# EAGLE design pc_tinyecg_max30001 (EAGLE 9.6.2)
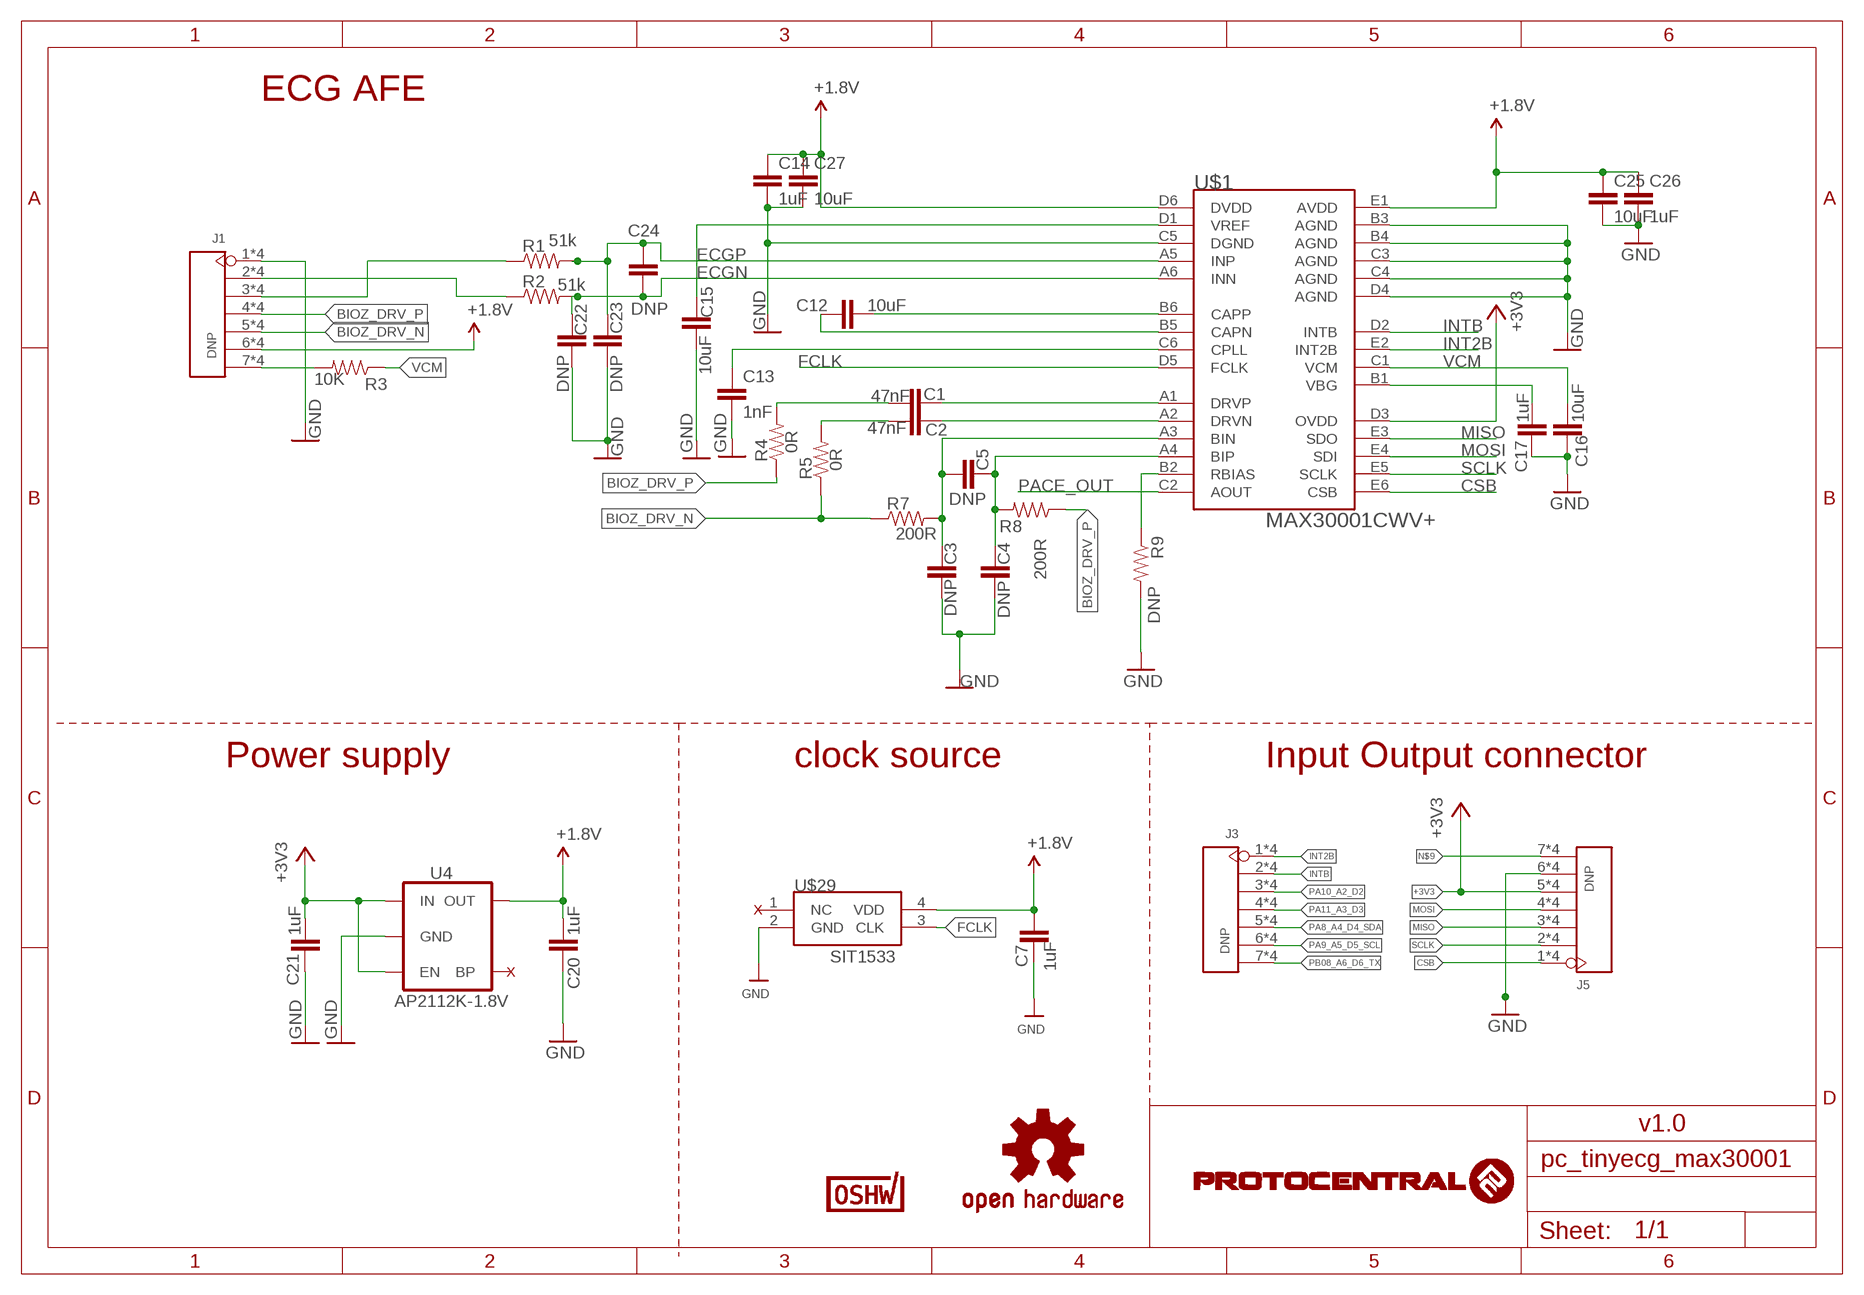
[diagram p0: schematic, sheet 1]

## Parts
C1  47nF  C-EUC0402  [C0402]
C2  47nF  C-EUC0402  [C0402]
C3  DNP  C-EUC0402  [C0402]
C4  DNP  C-EUC0402  [C0402]
C5  DNP  C-EUC0402  [C0402]
C7  1uF  C-EUC0402  [C0402]
C12  10uF  C-EUC0402  [C0402]
C13  1nF  C-EUC0402  [C0402]
C14  1uF  C-EUC0402  [C0402]
C15  10uF  C-EUC0402  [C0402]
C16  10uF  C-EUC0402  [C0402]
C17  1uF  C-EUC0402  [C0402]
C20  1uF  C-EUC0402  [C0402]
C21  1uF  C-EUC0402  [C0402]
C22  DNP  C-EUC0402  [C0402]
C23  DNP  C-EUC0402  [C0402]
C24  DNP  C-EUC0402  [C0402]
C25  10uF  C-EUC0402  [C0402]
C26  1uF  C-EUC0402  [C0402]
C27  10uF  C-EUC0402  [C0402]
J1  DNP  HEADER-7P-HALF-HOLE-2.54  [H7-HALF-HOLE-2.54]
J3  DNP  HEADER-7P-HALF-HOLE-2.54  [H7-HALF-HOLE-2.54]
J5  DNP  HEADER-7P-HALF-HOLE-2.54  [H7-HALF-HOLE-2.54]
R1  51k  RESISTOR0402-RES  [0402-RES]
R2  51k  RESISTOR0402-RES  [0402-RES]
R3  10K  RESISTOR0402-RES  [0402-RES]
R4  0R  RESISTOR0402-RES  [0402-RES]
R5  0R  RESISTOR0402-RES  [0402-RES]
R7  200R  RESISTOR0402-RES  [0402-RES]
R8  200R  RESISTOR0402-RES  [0402-RES]
R9  DNP  RESISTOR0402-RES  [0402-RES]
U4  AP2112K-1.8V  V_REG_LDOSMD  [SOT23-5]
U$1  MAX30001CWV+  [30WLP]
U$14  OSHW-LOGOM  [OSHW-LOGO-M]
U$29  SIT1533  [SIT1533]
U$35  CERT-SMALL  [CERT-SMALL-SILK]

## Nets
+1.8V: C7.2 C14.1 C20.2 C25.1 C26.1 C27.1 J1.6 J1.18 J1.P$6 J1.P$9 U4.5(OUT) U$1.D6(DVDD) U$1.E1(AVDD) U$29.4(VDD)
+3V3: C21.2 J5.5 J5.17 J5.P$5 J5.P$10 U4.1(IN) U4.3(EN) U$1.D3(OVDD)
BIOZ_DRV_N: J1.5 J1.17 J1.P$5 J1.P$10 R5.1 R7.1
BIOZ_DRV_P: J1.4 J1.16 J1.P$4 J1.P$11 R4.1 R8.1
CSB: J5.1 J5.13 J5.P$1 J5.P$14 U$1.E6(CSB)
ECGN: C22.1 C24.2 R2.2 U$1.A6(INN)
ECGN1: J1.2 J1.14 J1.P$2 J1.P$13 R2.1
ECGP: C23.1 C24.1 R1.2 U$1.A5(INP)
ECGP1: J1.3 J1.15 J1.P$3 J1.P$12 R1.1
FCLK: U$1.D5(FCLK) U$29.3(CLK)
GND: C3.2 C4.2 C7.1 C13.2 C14.2 C15.2 C16.2 C17.2 C20.1 C21.1 C22.2 C23.2 C25.2 C26.2 C27.2 J1.1 J1.13 J1.P$1 J1.P$14 J5.6 J5.18 J5.P$6 J5.P$9 R9.2 U4.2(GND) U$1.B3(AGND) U$1.B4(AGND) U$1.C3(AGND) U$1.C4(AGND) U$1.C5(DGND) U$1.D4(AGND) U$29.2(GND)
INT2B: J3.1 J3.13 J3.P$1 J3.P$14 U$1.E2(INT2B)
INTB: J3.2 J3.14 J3.P$2 J3.P$13 U$1.D2(INTB)
MISO: J5.3 J5.15 J5.P$3 J5.P$12 U$1.E3(SDO)
MOSI: J5.4 J5.16 J5.P$4 J5.P$11 U$1.E4(SDI)
N$1: C12.1 U$1.B6(CAPP)
N$2: C1.2 U$1.A1(DRVP)
N$3: C2.1 R5.2
N$4: C2.2 U$1.A2(DRVN)
N$5: C3.1 C5.1 R7.2 U$1.A3(BIN)
N$6: C4.1 C5.2 R8.2 U$1.A4(BIP)
N$7: R9.1 U$1.B2(RBIAS)
N$8: J1.7 J1.19 J1.P$7 J1.P$8 R3.2
N$9: J5.7 J5.19 J5.P$7 J5.P$8
N$10: C13.1 U$1.C6(CPLL)
N$11: C1.1 R4.2
N$12: C12.2 U$1.B5(CAPN)
N$13: C15.1 U$1.D1(VREF)
N$15: C17.1 U$1.B1(VBG)
PA8_A4_D4_SDA: J3.5 J3.17 J3.P$5 J3.P$10
PA9_A5_D5_SCL: J3.6 J3.18 J3.P$6 J3.P$9
PA10_A2_D2: J3.3 J3.15 J3.P$3 J3.P$12
PA11_A3_D3: J3.4 J3.16 J3.P$4 J3.P$11
PACE_OUT: U$1.C2(AOUT)
PB08_A6_D6_TX: J3.7 J3.19 J3.P$7 J3.P$8
SCLK: J5.2 J5.14 J5.P$2 J5.P$13 U$1.E5(SCLK)
VCM: C16.1 R3.1 U$1.C1(VCM)
Unconnected: U4.4(BP) U$29.1(NC)

## Notes on the sheet
- ECG AFE
- Power supply | clock source | Input Output connector
- X
- X
- v1.0

## Library data of the parts
C1-C5 C7 C12-C17 C20-C27 = rcl:C-EU: CAPACITOR, European symbol; SPICEPREFIX: C
J1 J3 J5 = circuitects:HEADER-7P-HALF-HOLE
R1-R5 R7-R9 = SparkFun:RESISTOR: Resistor Basic schematic elements and footprints for 0603, 1206, and PTH resistors.
U4 = SparkFun-PowerIC:V_REG_LDO: Voltage Regulator LDO Standard 150mA LDO voltage regulator in SOT-23 layout. Micrel part MIC5205. BP (by-pass) pin is used to lower output noise with 470pF cap.; PROD_ID: VREG-12457
U$1 = circuitects:MAX30001CWV+
U$14 = SparkFun:OSHW-LOGO: Open Source Hardware Logo This logo indicates the piece of hardware it is found on incorporates a OSHW license and/or adheres to the definition of open source hardware found here: http://freedomdefined.org/OSHW
U$29 = circuitects:SIT1533
U$35 = OSHWA:CERT

## Board
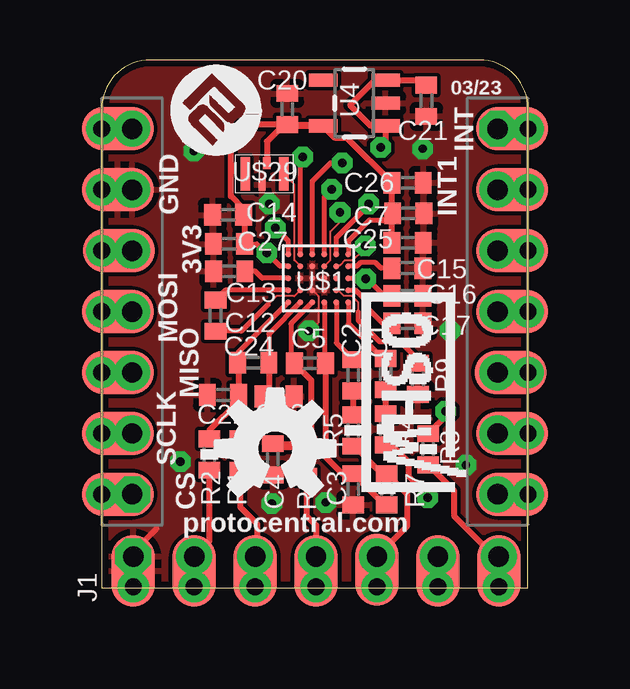
[diagram p1: board, top side]
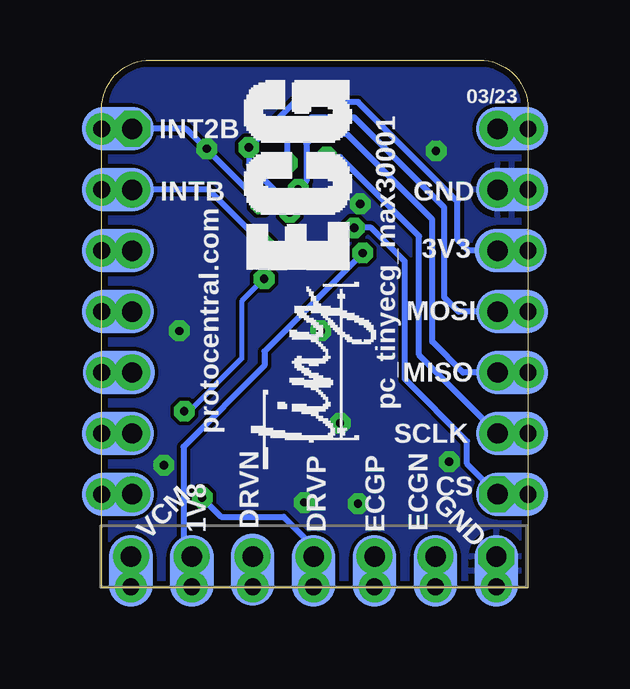
[diagram p2: board, bottom side, seen from below]

Size 17.78 x 22 mm. Coordinates in mm from the lower left corner, seen from the top.
Outline: 17.78,0 17.78,19.97 arc90 15.75,22 2.03,22 arc90 0,19.97 0,0 17.78,0
Copper layers (1*16): Top 0.035mm / dielectric 1.5mm / Bottom 0.035mm
Design rules "Circuitects-Rules *": minimum track width 2mil, minimum drill 0.05mm, track to track 0.06858125mm, track to pad 0.06858125mm, pad to pad 0.06858125mm, via to via 4mil, smd to smd 4mil, copper to edge 10mil, drill to drill 8mil, minimum pad ring 12mil, minimum via ring 10mil, stop-mask expansion 4mil, vias tented up to drill 25mil, thermal gap 10mil

### Footprints (pad centres in the part's own frame; a part is rotated, then mirrored left to right if it is on the bottom)
C0402 = smd 0.7 x 0.9: 1 -0.65,0; 2 0.65,0
H7-HALF-HOLE-2.54 = drill 0.85 pad 1.5 octagon: 1 0,7.62 | drill 0.85 pad 1.5: 2 0,5.08; 3 0,2.54; 4 0,0; 5 0,-2.54; 6 0,-5.08; 7 0,-7.62 | drill 0.7 pad 1.27: 13 -1.27,7.62; 14 -1.27,5.08; 15 -1.27,2.54; 16 -1.27,0; 17 -1.27,-2.54; 18 -1.27,-5.08; 19 -1.27,-7.62 | smd 3 x 1.82: P$1 -0.6,7.62; P$2 -0.6,5.08; P$3 -0.6,2.54; P$4 -0.6,0; P$5 -0.55,-2.54; P$6 -0.6,-5.08; P$7 -0.6,-7.62 | smd 3 x 1.82 bottom: P$8 -0.6,-7.62; P$9 -0.6,-5.08; P$10 -0.55,-2.54; P$11 -0.6,0; P$12 -0.6,2.54; P$13 -0.6,5.08; P$14 -0.6,7.62
0402-RES = smd 0.7 x 0.9: 1 -0.65,0; 2 0.65,0
SOT23-5 = smd 0.55 x 1.2: 1 -0.95,-1.3; 2 0,-1.3; 3 0.95,-1.3; 4 0.95,1.3; 5 -0.95,1.3
30WLP = smd 0.25 x 0.25: A1 -1.25,1; A2 -0.75,1; A3 -0.25,1; A4 0.25,1; A5 0.75,1; A6 1.25,1; B1 -1.25,0.5; B2 -0.75,0.5; B3 -0.25,0.5; B4 0.25,0.5; B5 0.75,0.5; B6 1.25,0.5; C1 -1.25,0; C2 -0.75,0; C3 -0.25,0; C4 0.25,0; C5 0.75,0; C6 1.25,0; D1 -1.25,-0.5; D2 -0.75,-0.5; D3 -0.25,-0.5; D4 0.25,-0.5; D5 0.75,-0.5; D6 1.25,-0.5; E1 -1.25,-1; E2 -0.75,-1; E3 -0.25,-1; E4 0.25,-1; E5 0.75,-1; E6 1.25,-1
SIT1533 = smd 0.4 x 1.4: 1 -0.8,0; 3 0.8,0 | smd 0.3 x 0.5: 2 -0.1,-0.45; 4 0.1,0.45

### Placement (x,y rotation side)
C1  11.84,8.9 90 top
C2  10.49,8.85 90 top
C3  10.49,4.1 270 top
C4  7.14,5.35 270 top
C5  8.69,9.35 180 top
C7  12.79,15.6 180 top
C12  4.75,11.34 270 top
C13  5.32,13.19 180 top
C14  5.27,15.54 180 top
C15  12.75,13.32 0 top
C16  12.75,12.17 0 top
C17  12.75,11.02 0 top
C20  7.74,19.95 270 top
C21  13.54,20.3 90 top
C22  5.06,8.03 180 top
C23  7.37,7.97 0 top
C24  6.32,9.37 180 top
C25  12.76,14.38 0 top
C26  12.76,16.88 0 top
C27  5.31,14.33 180 top
J1  8.94,1.3 90 top
J3  16.51,11.51 0 bottom
J5  1.27,11.51 180 bottom
R1  5.79,5.55 90 top
R2  4.49,5.55 90 top
R3  13.62,5.77 270 top
R4  11.84,6.6 90 top
R5  10.49,6.55 90 top
R7  11.89,4.1 270 top
R8  8.54,5.3 90 top
R9  13.19,8.7 270 top
U4  10.54,20.2 90 top
U$1  9.04,12.9 180 top
U$4  [TNYECG_LOGO]  5.99,3.9 90 bottom
U$5  [PCROUNDLOGO]  -0.76,15.85 0 top
U$14  7.24,5.8 0 top
U$29  6.79,17.25 0 top
U$35  10.84,8.15 270 top

### Tracks (layer width: path | path; a pad name or v marks a point on that pad's centre or on a via)
+1.8V  (via drill 0.35)
  Top 0.2: 11.71,15.33 11.17,15.33 10.29,14.45 U$1.E1 | C27.1 6.46,14.33 6.84,13.95 v6.89,13.95 7.44,13.4 U$1.D6
  Top 0.254: C26.1 12.14,16.85 | C27.1 5.96,15.5 C14.1 5.92,15.79 5.39,16.32 5.39,18.9 5.79,19.3 C20.2 9.19,19.3 U4.5 | U4.5 7.54,19.25 6.89,18.6 U$29.4 | U4.5 9.74,18.75 10.24,18.75 C26.1 | J1.18 J1.6 J1.P$9 | C26.1 12.11,15.63 C7.2 | C25.1 12.11,15.57 C7.2 | 11.71,15.33 11.87,15.33 C7.2
  Bottom 0.254: v6.89,13.95 10.99,9.85 10.99,9.25 14.37,5.87 14.37,1.65 J1.6 J1.P$9
+3V3  (via drill 0.35)
  Top 0.076: U$1.D3 9.54,13.65 9.54,14.85 9.89,15.2 9.89,15.59 v9.94,15.64
  Top 0.254: C21.2 13.34,21.15 U4.3 11.79,21.2 11.44,21.2 10.37,20.12 11.24,19.25 U4.1 11.84,18.55 v11.64,18.35 | J5.P$10 J5.5
  Bottom 0.254: J5.17 J5.5 | J5.5 2.49,14.05 2.94,14.5 2.94,16.1 7.09,20.25 9.74,20.25 v11.64,18.35 11.64,17.65 10.4,16.41 10.4,16.11 v9.94,15.65 v9.94,15.64 | J5.P$10 J5.5
BIOZ_DRV_N
  Top 0.254: R5.1 10.54,5.9 11.69,4.75 R7.1 12.74,3.9 12.74,2.56 J1.5 J1.P$10 J1.17
  Bottom 0.254: J1.P$10 J1.17
BIOZ_DRV_P  (via drill 0.35)
  Top 0.254: J1.16 J1.4 | R4.1 12.09,5.95 12.79,5.25 12.79,4.65 13.59,3.85 v13.59,3.75 | R8.1 8.54,3 8.94,2.6 J1.4 | J1.P$11 J1.4
  Bottom 0.254: v13.59,3.75 12.79,2.95 10.19,2.95 8.94,1.7 J1.4 J1.P$11
CSB  (via drill 0.35)
  Top 0.2: U$1.E6 7.79,14.45 v7.24,15
  Top 0.254: J5.P$14 J5.1
  Bottom 0.254: J5.13 J5.P$14 J5.1 2.54,5.16 2.54,6.1 5.14,8.7 5.14,13.6 6.54,15 v7.24,15
ECGN
  Top 0.2: U$1.A6 5.67,9.78 C24.2
  Top 0.254: C24.2 5.71,9.33 C22.1 5.71,7.77 4.49,6.55 R2.2
ECGN1
  Top 0.254: R2.1 4.49,1.93 J1.2 | J1.14 J1.2 | J1.P$13 J1.2
  Bottom 0.254: J1.P$13 J1.2
ECGP
  Top 0.2: U$1.A5 6.97,10.58 C24.1
  Top 0.254: C24.1 6.97,8.22 C23.1 6.72,7.13 R1.2
ECGP1
  Top 0.254: R1.1 5.79,3.35 6.49,2.65 6.49,1.39 J1.3 | J1.15 J1.3 | J1.P$12 J1.3
  Bottom 0.254: J1.P$12 J1.3
FCLK
  Top 0.076: U$1.D5 8.04,13.65 8.04,16.8 U$29.3
GND  (via drill 0.35)
  Top 0.076: U$1.B4 9.04,12.15 9.04,11.05 8.69,10.7
  Top 0.254: J1.13 J1.P$14 J1.1 1.32,1.48 2.29,2.45 | J5.P$9 J5.6
  Bottom 0.254: J1.P$14 J1.1 | J5.6 J5.P$9 J5.18
  other vias: 13.39,18.3 14.54,10.7 8.64,10.7 6.99,16 7.09,3.5 15.19,5.1 3.29,5.25 3.84,18.2 7.84,6.85 9.34,3.55
  pour Bottom (isolate 0.152): 0,0 17.78,0 17.78,22.43 0,22.43
  pour Top (isolate 0.152): 0,0 0,22.43 17.78,22.43 17.78,0
INT2B  (via drill 0.35)
  Top 0.2: U$1.E2 9.79,14.6 11.14,15.95 v11.14,16
  Top 0.254: J3.P$14 J3.1
  Bottom 0.254: v11.14,16 14.27,19.13 J3.1 J3.13 J3.P$14
INTB  (via drill 0.35)
  Top 0.076: U$1.D2 9.85,13.46 9.95,13.46 10.14,13.65 10.49,13.65 10.89,14.05
  Top 0.2: v10.99,14.25 10.89,14.25 10.89,14.05
  Top 0.254: J3.P$13 J3.2
  Bottom 0.254: v10.99,14.25 13.33,16.59 J3.2 J3.14 J3.P$13
MISO  (via drill 0.35)
  Top 0.2: U$1.E3 9.29,16.3 v9.59,16.6
  Top 0.254: J5.P$12 J5.3
  Bottom 0.254: J5.3 2.71,8.97 3.99,10.25 3.99,15.35 7.54,18.9 8.84,18.9 9.24,18.5 9.24,16.95 v9.59,16.6 | J5.3 J5.15 | J5.P$12 J5.3
MOSI  (via drill 0.35)
  Top 0.2: U$1.E4 8.79,16.95 9.54,17.7 v10.04,17.7
  Top 0.254: J5.P$11 J5.4
  Bottom 0.254: J5.4 2.9,11.51 3.49,12.1 3.49,15.85 7.24,19.6 9.04,19.6 10.04,18.6 v10.04,17.7 | J5.4 J5.16 | J5.P$11 J5.4
N$1
  Top 0.2: U$1.B6 5.16,12.4 C12.1
N$2
  Top 0.2: U$1.A1 10.29,11 11.74,9.55 C1.2
N$3
  Top 0.254: C2.1 R5.2
N$4
  Top 0.2: U$1.A2 9.79,10.2 C2.2
N$5
  Top 0.2: U$1.A3 9.29,9.4 C5.1
  Top 0.254: C5.1 9.34,5.45 10.04,4.75 C3.1 11.79,3.45 R7.2
N$6
  Top 0.2: U$1.A4 7.89,11 7.89,9.5 C5.2
  Top 0.254: C5.2 8.74,8.65 8.74,6.35 8.39,6 C4.1 7.29,5.85 8.44,5.85 R8.2
N$7
  Top 0.076: U$1.B2 9.86,12.4 10.09,12.17 10.42,12.17 10.69,11.9 10.69,11.5
  Top 0.2: 10.69,11.5 10.69,11.15 11.59,10.25 12.44,10.25 13.19,9.5 R9.1
N$8
  Top 0.254: J1.19 J1.P$8 J1.7 16.24,1.3 16.24,1.45 14.69,3 14.69,4.05 R3.2
  Bottom 0.254: J1.P$8 J1.7
N$9
  Top 0.254: J5.P$8 J5.7
  Bottom 0.254: J5.19 J5.7 J5.P$8
N$10
  Top 0.2: U$1.C6 6.69,12.9 6.4,13.19 C13.1
N$11
  Top 0.254: C1.1 R4.2
N$12
  Top 0.076: U$1.B5 8.04,12.15 7.29,12.15 6.94,11.8
  Top 0.2: 6.94,11.8 5.83,10.69 C12.2
N$13
  Top 0.2: C15.1 11.65,13.32 11.42,13.55 10.79,13.55 10.64,13.4 U$1.D1
N$15
  Top 0.2: U$1.B1 10.59,12.4 10.99,12 10.99,11.75 11.72,11.02 C17.1
PA8_A4_D4_SDA
  Top 0.254: J3.5 J3.P$10 J3.17
  Bottom 0.254: J3.17 J3.P$10 16.84,8.97 J3.5
PA9_A5_D5_SCL
  Top 0.254: J3.P$9 J3.6
  Bottom 0.254: J3.6 J3.18 J3.P$9
PA10_A2_D2
  Top 0.254: J3.P$12 J3.3
  Bottom 0.254: J3.3 J3.15 J3.P$12
PA11_A3_D3
  Top 0.254: J3.P$11 J3.4
  Bottom 0.254: J3.4 J3.16 J3.P$11
PB08_A6_D6_TX
  Top 0.254: J3.P$8 J3.7
  Bottom 0.254: J3.7 J3.19 J3.P$8
SCLK  (via drill 0.35)
  Top 0.2: U$1.E5 8.29,17.85 v8.39,17.95
  Top 0.254: J5.P$13 J5.2
  Bottom 0.254: J5.14 J5.2 | J5.2 4.54,9.7 4.54,14.65 7.84,17.95 v8.39,17.95 | J5.P$13 J5.2
VCM  (via drill 0.35)
  Top 0.2: U$1.C1 11.04,12.9 | 11.04,12.9 v11.02,12.88 v11.01,12.88 | C16.1 11.77,12.17 11.04,12.9
  Top 0.254: R3.1 14.34,7.14 v14.34,7.35
  Bottom 0.2: v11.01,12.88 11.94,11.94 11.94,9.55 14.14,7.35 v14.34,7.35

### Text on the board
tPlace: 03/23 | INT | INT1 | GND | 3V3 | MOSI | MISO | SCLK | CS | protocentral.com
bPlace: 03/23 | INT2B | GND | INTB | protocentral.com | 3V3 | MOSI | MISO | pc_tinyecg_max30001 | SCLK | CS | GND | ECGN | ECGP | DRVP | DRVN | 1V8 | VCM
tTest: J4